# Altium schematic sheet 03 Arm Base Control Unit.SchDoc
size 558 x 355 mm
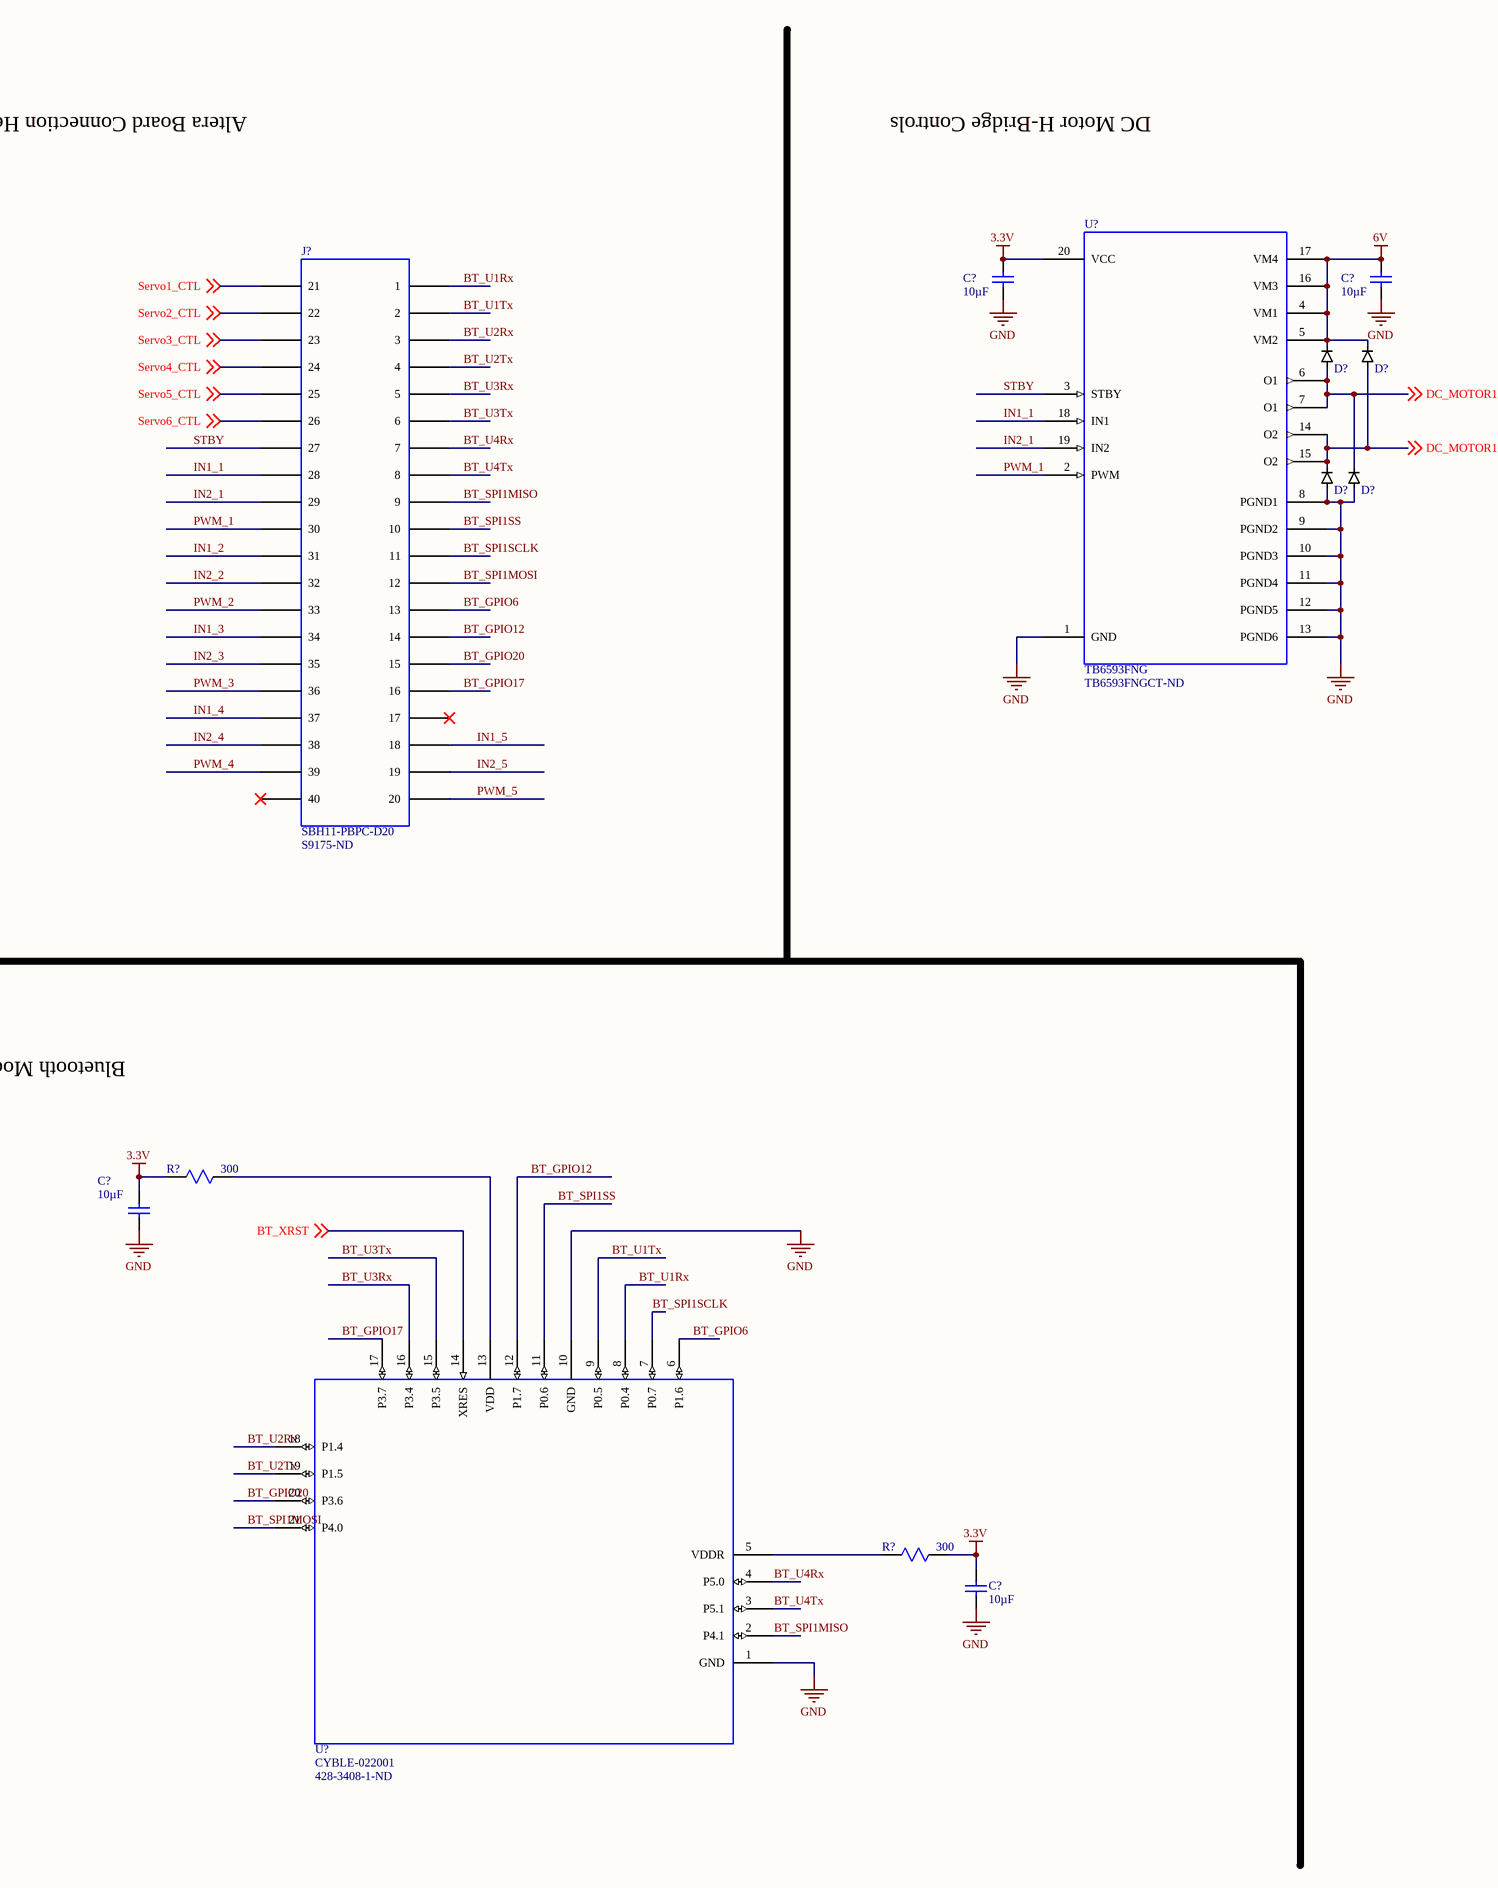
[diagram p0: 03 Arm Base Control Unit.SchDoc, left]
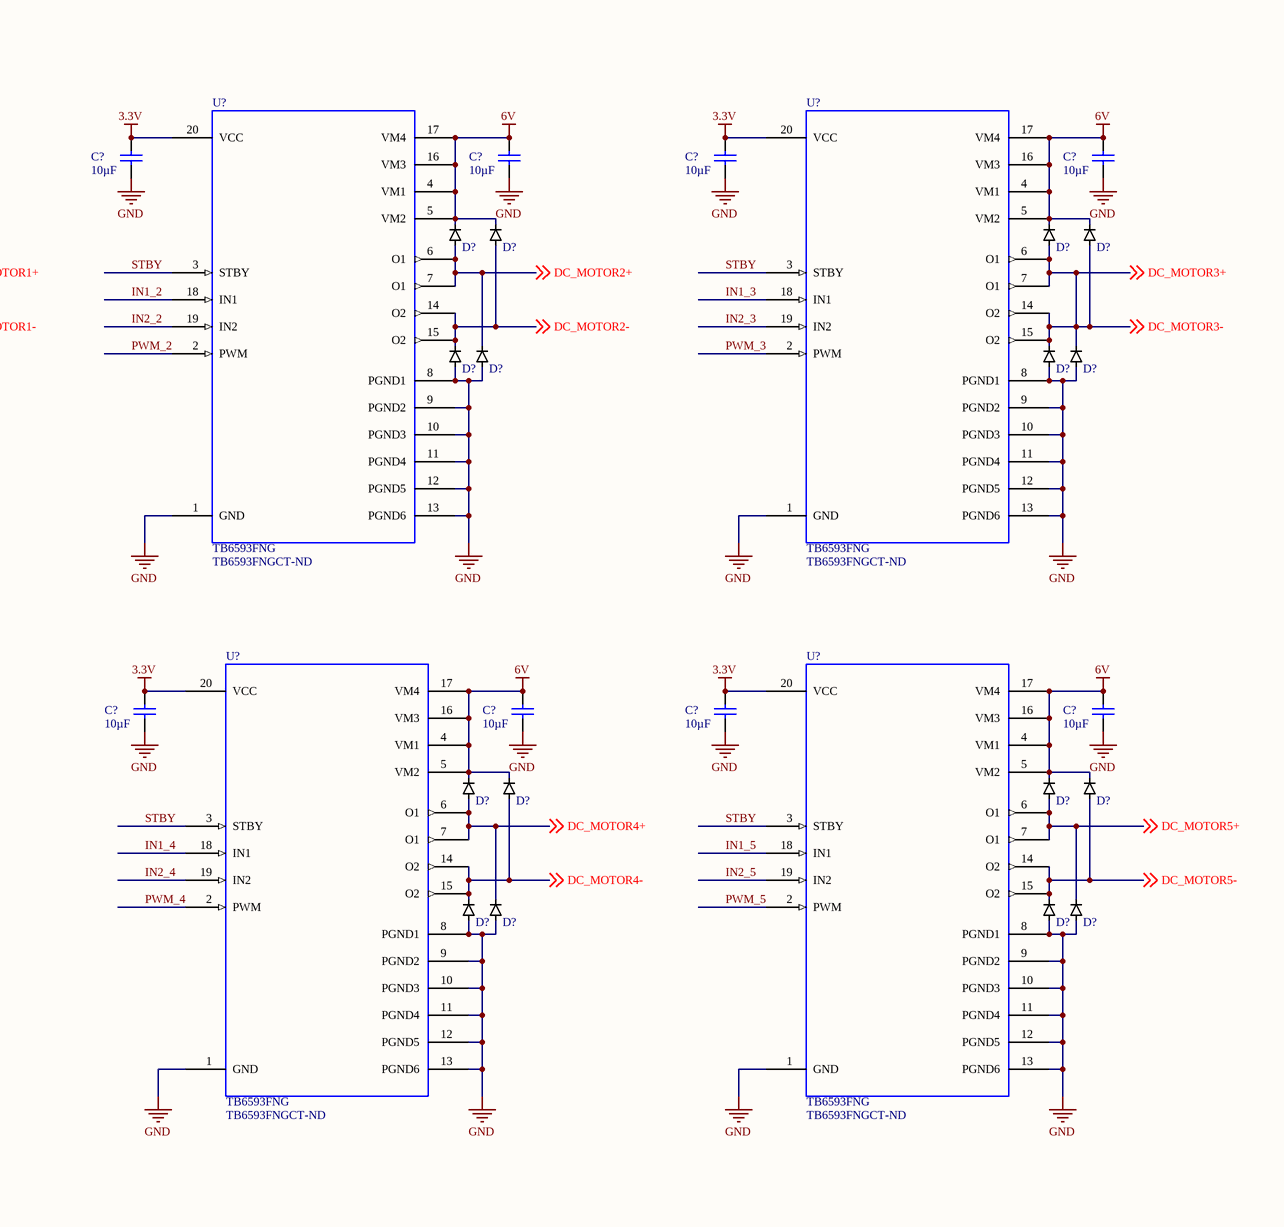
[diagram p1: 03 Arm Base Control Unit.SchDoc, right]

## Parts
(Parts that share a designator on the sheet are numbered #1, #2 ... from top to bottom, then left to right.)
C?#1  value 10µF  [CAP_0805]  (hidden comment: CAP_0805_U_010_00)
C?#2  value 10µF  [CAP_0805]  (hidden comment: CAP_0805_U_010_00)
C?#3  value 10µF  [CAP_0805]  (hidden comment: CAP_0805_U_010_00)
C?#4  value 10µF  [CAP_0805]  (hidden comment: CAP_0805_U_010_00)
C?#5  value 10µF  [CAP_0805]  (hidden comment: CAP_0805_U_010_00)
C?#6  value 10µF  [CAP_0805]  (hidden comment: CAP_0805_U_010_00)
C?#7  value 10µF  [CAP_0805]  (hidden comment: CAP_0805_U_010_00)
C?#8  value 10µF  [CAP_0805]  (hidden comment: CAP_0805_U_010_00)
C?#9  value 10µF  [CAP_0805]  (hidden comment: CAP_0805_U_010_00)
C?#10  value 10µF  [CAP_0805]  (hidden comment: CAP_0805_U_010_00)
C?#11  value 10µF  [CAP_0805]  (hidden comment: CAP_0805_U_010_00)
C?#12  value 10µF  [CAP_0805]  (hidden comment: CAP_0805_U_010_00)
D?#1  DB2W40100LCT-ND  (value not drawn)
D?#2  DB2W40100LCT-ND  (value not drawn)
D?#3  DB2W40100LCT-ND  (value not drawn)
D?#4  DB2W40100LCT-ND  (value not drawn)
D?#5  DB2W40100LCT-ND  (value not drawn)
D?#6  DB2W40100LCT-ND  (value not drawn)
D?#7  DB2W40100LCT-ND  (value not drawn)
D?#8  DB2W40100LCT-ND  (value not drawn)
D?#9  DB2W40100LCT-ND  (value not drawn)
D?#10  DB2W40100LCT-ND  (value not drawn)
D?#11  DB2W40100LCT-ND  (value not drawn)
D?#12  DB2W40100LCT-ND  (value not drawn)
D?#13  DB2W40100LCT-ND  (value not drawn)
D?#14  DB2W40100LCT-ND  (value not drawn)
D?#15  DB2W40100LCT-ND  (value not drawn)
D?#16  DB2W40100LCT-ND  (value not drawn)
D?#17  DB2W40100LCT-ND  (value not drawn)
D?#18  DB2W40100LCT-ND  (value not drawn)
D?#19  DB2W40100LCT-ND  (value not drawn)
D?#20  DB2W40100LCT-ND  (value not drawn)
J?  value SBH11-PBPC-D20  Supplier Part Number 1: S9175-ND  (hidden comment: SBH11-PBPC-D20-ST-BK)
R?#1  value 300  (hidden comment: RC0402JR-07300RL)
R?#2  value 300  (hidden comment: RC0402JR-07300RL)
U?#1  Supplier Part Number 1: TB6593FNGCT-ND  (hidden comment: TB6593FNG)
U?#2  Supplier Part Number 1: TB6593FNGCT-ND  (hidden comment: TB6593FNG)
U?#3  Supplier Part Number 1: TB6593FNGCT-ND  (hidden comment: TB6593FNG)
U?#4  Supplier Part Number 1: TB6593FNGCT-ND  (hidden comment: TB6593FNG)
U?#5  Supplier Part Number 1: TB6593FNGCT-ND  (hidden comment: TB6593FNG)
U?#6  value CYBLE-022001  Supplier Part Number 1: 428-3408-1-ND  (hidden comment: CYBLE-022001-00)

## Nets
3.3V: C?#1.2 C?#3.2 C?#5.2 C?#7.2 C?#9.2 C?#11.2 C?#12.2 R?#1.1 R?#2.2 U?#1.20(VCC) U?#2.20(VCC) U?#3.20(VCC) U?#4.20(VCC) U?#5.20(VCC)
6V: C?#2.2 C?#4.2 C?#6.2 C?#8.2 C?#10.2 D?#1.41 D?#2.41 D?#3.41 D?#4.41 D?#5.41 D?#6.41 D?#13.41 D?#14.41 D?#15.41 D?#16.41 U?#1.4(VM1) U?#1.5(VM2) U?#1.16(VM3) U?#1.17(VM4) U?#2.4(VM1) U?#2.5(VM2) U?#2.16(VM3) U?#2.17(VM4) U?#3.4(VM1) U?#3.5(VM2) U?#3.16(VM3) U?#3.17(VM4) U?#4.4(VM1) U?#4.5(VM2) U?#4.16(VM3) U?#4.17(VM4) U?#5.4(VM1) U?#5.5(VM2) U?#5.16(VM3) U?#5.17(VM4)
GND: C?#1.1 C?#2.1 C?#3.1 C?#4.1 C?#5.1 C?#6.1 C?#7.1 C?#8.1 C?#9.1 C?#10.1 C?#11.1 C?#12.1 D?#7.42 D?#8.42 D?#9.42 D?#10.42 D?#11.42 D?#12.42 D?#17.42 D?#18.42 D?#19.42 D?#20.42 U?#1.1(GND) U?#1.8(PGND1) U?#1.9(PGND2) U?#1.10(PGND3) U?#1.11(PGND4) U?#1.12(PGND5) U?#1.13(PGND6) U?#2.1(GND) U?#2.8(PGND1) U?#2.9(PGND2) U?#2.10(PGND3) U?#2.11(PGND4) U?#2.12(PGND5) U?#2.13(PGND6) U?#3.1(GND) U?#3.8(PGND1) U?#3.9(PGND2) U?#3.10(PGND3) U?#3.11(PGND4) U?#3.12(PGND5) U?#3.13(PGND6) U?#4.1(GND) U?#4.8(PGND1) U?#4.9(PGND2) U?#4.10(PGND3) U?#4.11(PGND4) U?#4.12(PGND5) U?#4.13(PGND6) U?#5.1(GND) U?#5.8(PGND1) U?#5.9(PGND2) U?#5.10(PGND3) U?#5.11(PGND4) U?#5.12(PGND5) U?#5.13(PGND6) U?#6.1(GND) U?#6.10(GND)
BT_GPIO6: J?.13 U?#6.6(P1.6)
BT_GPIO12: J?.14 U?#6.12(P1.7)
BT_GPIO17: J?.16 U?#6.17(P3.7)
BT_GPIO20: J?.15 U?#6.20(P3.6)
BT_SPI1MISO: J?.9 U?#6.2(P4.1)
BT_SPI1MOSI: J?.12 U?#6.21(P4.0)
BT_SPI1SCLK: J?.11 U?#6.7(P0.7)
BT_SPI1SS: J?.10 U?#6.11(P0.6)
BT_U1Rx: J?.1 U?#6.8(P0.4)
BT_U1Tx: J?.2 U?#6.9(P0.5)
BT_U2Rx: J?.3 U?#6.18(P1.4)
BT_U2Tx: J?.4 U?#6.19(P1.5)
BT_U3Rx: J?.5 U?#6.16(P3.4)
BT_U3Tx: J?.6 U?#6.15(P3.5)
BT_U4Rx: J?.7 U?#6.4(P5.0)
BT_U4Tx: J?.8 U?#6.3(P5.1)
BT_XRST: U?#6.14(XRES) ; off-sheet BT_XRST
DC_MOTOR1+: D?#1.42 D?#8.41 U?#1.6(O1) U?#1.7(O1) ; off-sheet DC_MOTOR1+
DC_MOTOR1-: D?#2.42 D?#7.41 U?#1.14(O2) U?#1.15(O2) ; off-sheet DC_MOTOR1-
DC_MOTOR2+: D?#3.42 D?#10.41 U?#2.6(O1) U?#2.7(O1) ; off-sheet DC_MOTOR2+
DC_MOTOR2-: D?#4.42 D?#9.41 U?#2.14(O2) U?#2.15(O2) ; off-sheet DC_MOTOR2-
DC_MOTOR3+: D?#5.42 D?#6.42 D?#11.41 D?#12.41 U?#3.6(O1) U?#3.7(O1) U?#3.14(O2) U?#3.15(O2) ; off-sheet DC_MOTOR3+, off-sheet DC_MOTOR3-  [also labelled DC_MOTOR3-]
DC_MOTOR4+: D?#13.42 D?#18.41 U?#4.6(O1) U?#4.7(O1) ; off-sheet DC_MOTOR4+
DC_MOTOR4-: D?#14.42 D?#17.41 U?#4.14(O2) U?#4.15(O2) ; off-sheet DC_MOTOR4-
DC_MOTOR5+: D?#15.42 D?#20.41 U?#5.6(O1) U?#5.7(O1) ; off-sheet DC_MOTOR5+
DC_MOTOR5-: D?#16.42 D?#19.41 U?#5.14(O2) U?#5.15(O2) ; off-sheet DC_MOTOR5-
IN1_1: J?.28 U?#1.18(IN1)
IN1_2: J?.31 U?#2.18(IN1)
IN1_3: J?.34 U?#3.18(IN1)
IN1_4: J?.37 U?#4.18(IN1)
IN1_5: J?.18 U?#5.18(IN1)
IN2_1: J?.29 U?#1.19(IN2)
IN2_2: J?.32 U?#2.19(IN2)
IN2_3: J?.35 U?#3.19(IN2)
IN2_4: J?.38 U?#4.19(IN2)
IN2_5: J?.19 U?#5.19(IN2)
PWM_1: J?.30 U?#1.2(PWM)
PWM_2: J?.33 U?#2.2(PWM)
PWM_3: J?.36 U?#3.2(PWM)
PWM_4: J?.39 U?#4.2(PWM)
PWM_5: J?.20 U?#5.2(PWM)
Servo1_CTL: J?.21 ; off-sheet Servo1_CTL
Servo2_CTL: J?.22 ; off-sheet Servo2_CTL
Servo3_CTL: J?.23 ; off-sheet Servo3_CTL
Servo4_CTL: J?.24 ; off-sheet Servo4_CTL
Servo5_CTL: J?.25 ; off-sheet Servo5_CTL
Servo6_CTL: J?.26 ; off-sheet Servo6_CTL
STBY: J?.27 U?#1.3(STBY) U?#2.3(STBY) U?#3.3(STBY) U?#4.3(STBY) U?#5.3(STBY)
NetR?#1_2: R?#1.2 U?#6.13(VDD)
NetR?#2_1: R?#2.1 U?#6.5(VDDR)

Not connected (* = marked no-connect by the designer): J? 17* 40*

## Notes on the sheet
- Altera Board Connection Header
- DC Motor H-Bridge Controls
- Bluetooth Module

## Library data of the parts
C?#1-C?#12 = CAP_0805_U_010_00: CAP CER 10UF 10V X5R 0805; Manufacturer: Samsung Electro-Mechanics America, Inc.; Manufacturer Part Number: CL21A106KPCLQNC; Tolerance: ±10%; Supplier 1: Digi-Key; Supplier Part Number 1: 1276-2402-1-ND; RoHS: RoHS Compliant; Category: Capacitors; Stock 1: 97192; Pricing 1: 1=0.2, 10=0.14, 25=0.1052, 50=0.0806, 100=0.0665, 500=0.0469, 1000=0.0385 (USD); Packaging: Cut Tape (CT); Voltage - Rated: 10V; Temperature Coefficient: X5R; Mounting Type: Surface Mount, MLCC; Operating Temperature: -55°C ~ 85°C; Applications: General Purpose; Ratings: -; Package / Case: 0805 (2012 Metric); Size / Dimension: 0.079" L x 0.049" W (2.00mm x 1.25mm); Height - Seated (Max): -; Thickness (Max): 0.037" (0.95mm); Lead Spacing: -; Features: -; Lead Style: -; ComponentLink1URL: http://media.digikey.com/pdf/Data%20Sheets/Samsung%20PDFs/CL21A106KPCLQNC_character.pdf; ComponentLink1Description: http://media.digikey.com/pdf/Data%20Sheets/Samsung%20PDFs/CL21A106KPCLQNC_character.pdf
D?#1-D?#20 = DB2W40100LCT-ND: Diode 1A; Manufacturer: Panasonic Electronic Components; Diode Type: Standard; Voltage - DC Reverse (Vr) (Max): 40V; Current - Average Rectified (Io): 1A (DC); Voltage - Forward (Vf) (Max) @ If: 390mV @ 1A; Speed: Fast Recovery =< 500ns, > 200mA (Io); Reverse Recovery Time (trr): 15ns; Current - Reverse Leakage @ Vr: 250µA @ 40V; Capacitance @ Vr, F: 50pF @ 10V, 1MHz; Supplier 1: Digi-Key; Manufacturer Part Number: DB2W40100L; RoHS: RoHS Compliant; Category: Discrete Semiconductor Products; Stock 1: 4900; Pricing 1: 1=0.2, 10=0.174, 25=0.1396, 100=0.1086, 250=0.10548, 500=0.10236, 1000=0.09306 (USD); Packaging: Cut Tape (CT); Mounting Type: Surface Mount; Package / Case: SOD-123F; Supplier Device Package: Mini2-F3-B; Operating Temperature - Junction: 150°C (Max); ComponentLink1URL: http://industrial.panasonic.com/www-cgi/jvcr13pz.cgi?E+SC+4+CDF7001+DB2W401+8+WW; ComponentLink1Description: http://industrial.panasonic.com/www-cgi/jvcr13pz.cgi?E+SC+4+CDF7001+DB2W401+8+WW; Supplier Part Number 1: DB2W40100LCT-ND
J? = SBH11-PBPC-D20-ST-BK: 40 PIN BOX HEADER LINE; Manufacturer: Sullins Connector Solutions; Connector Type: Header, Shrouded; Number of Positions: 40; Number of Positions Loaded: All; Pitch: 0.100" (2.54mm); Supplier 1: Digi-Key; Manufacturer Part Number: SBH11-PBPC-D20-ST-BK; RoHS: RoHS Compliant; Category: Connectors, Interconnects; Stock 1: 2900; Pricing 1: 1=0.91, 10=0.753, 25=0.6976, 50=0.6278, 100=0.558, 250=0.48824, 500=0.4464, 1000=0.40455, 2500=0.3627 (USD); Packaging: Tray; Contact Type: Male Pin; Number of Rows: 2; Row Spacing: 0.100" (2.54mm); Contact Mating Length: -; Mounting Type: Through Hole; Termination: Solder; Fastening Type: -; Features: Polarizing Key; Contact Finish: Gold; Contact Finish Thickness: Flash; Color: Black; ComponentLink1URL: http://sullinscorp.com/catalogs/145_PAGE118_.100_SBH11_SERIES_MALE_BOX_HDR_ST_RA_SMT.pdf; ComponentLink1Description: http://sullinscorp.com/catalogs/145_PAGE118_.100_SBH11_SERIES_MALE_BOX_HDR_ST_RA_SMT.pdf
R?#1 R?#2 = RC0402JR-07300RL: RES SMD 300 OHM 5%; Manufacturer: Yageo; Power (Watts): 0.063W, 1/16W; Temperature Coefficient: ±100ppm/°C; Supplier 1: Digi-Key; Manufacturer Part Number: RC0402JR-07300RL; RoHS: RoHS Compliant; Category: Resistors; Stock 1: 32725; Pricing 1: 1=0.1, 10=0.012, 25=0.0084, 100=0.0047, 250=0.0036, 500=0.0029, 1000=0.00213, 2500=0.00185, 5000=0.00153 (USD); Packaging: Cut Tape (CT); Resistance (Ohms): 300; Tolerance: ±5%; Composition: Thick Film; Features: Moisture Resistant; Operating Temperature: -55°C ~ 155°C; Package / Case: 0402 (1005 Metric); Supplier Device Package: 0402; Size / Dimension: 0.039" L x 0.020" W (1.00mm x 0.50mm); Height: 0.016" (0.40mm); Number of Terminations: 2; ComponentLink1URL: http://www.yageo.com/NewPortal/yageodocoutput?fileName=/pdf/R-Chip/PYu-RC_Group_51_RoHS_L_3.pdf; ComponentLink1Description: http://www.yageo.com/NewPortal/yageodocoutput?fileName=/pdf/R-Chip/PYu-RC_Group_51_RoHS_L_3.pdf; Supplier Part Number 1: 311-300JRCT-ND
U?#1-U?#5 = TB6593FNG: DC Motor Driver IC; Manufacturer: Toshiba Semiconductor and Storage; Manufacturer Part Number: TB6593FNG(O,EL); Motor Type - AC, DC: Brushed DC; Function: Driver - Fully Integrated, Control and Power Stage; Output Configuration: Half Bridge (2); Interface: PWM; Current - Output: 1A; Voltage - Supply: 2.7 V ~ 5.5 V; Voltage - Load: 2.5 V ~ 13.5 V; Supplier 1: Digi-Key; RoHS: RoHS Compliant; Category: Integrated Circuits (ICs); Stock 1: 2894; Pricing 1: 1=2.65, 10=2.39, 25=2.1416, 100=1.9256, 250=1.7098, 500=1.494, 1000=1.2367 (USD); Packaging: Cut Tape (CT); Motor Type - Stepper: -; Technology: Power MOSFET; Step Resolution: -; Applications: General Purpose; Operating Temperature: -20°C ~ 85°C (TA); Mounting Type: Surface Mount; Package / Case: 20-LSSOP (0.173", 4.40mm Width); Supplier Device Package: 20-SSOP; ComponentLink1URL: http://toshiba.semicon-storage.com/info/docget.jsp?did=10658&prodName=TB6593FNG; ComponentLink1Description: http://toshiba.semicon-storage.com/info/docget.jsp?did=10658&prodName=TB6593FNG; Value: TB6593FNG
U?#6 = CYBLE-022001-00: EZ-BLE PRoC Module; Manufacturer: Cypress Semiconductor Corp; RF Family/Standard: Bluetooth; Protocol: Bluetooth v4.1 Low Energy (BLE); Frequency: 2.4GHz; Data Rate: 1Mbps; Power - Output: 3dBm; Sensitivity: -91dBm; Serial Interfaces: I²C, SPI, UART; Antenna Type: Integrated, Chip; Memory Size: 128kB Flash, 16kB SRAM; Voltage - Supply: 1.8 V ~ 4.5 V; Current - Receiving: 16.4mA; Current - Transmitting: 15.6mA; Supplier 1: Digi-Key; Manufacturer Part Number: CYBLE-022001-00; RoHS: RoHS Compliant; Category: RF/IF and RFID; Stock 1: 1211; Pricing 1: 1=11.9, 25=10.0084, 100=9.4675, 250=8.656 (USD); Packaging: Cut Tape (CT); Modulation: -; Mounting Type: Surface Mount; Operating Temperature: -40°C ~ 85°C; Package / Case: Module; ComponentLink1URL: http://www.cypress.com/file/140791/download; ComponentLink1Description: http://www.cypress.com/file/140791/download